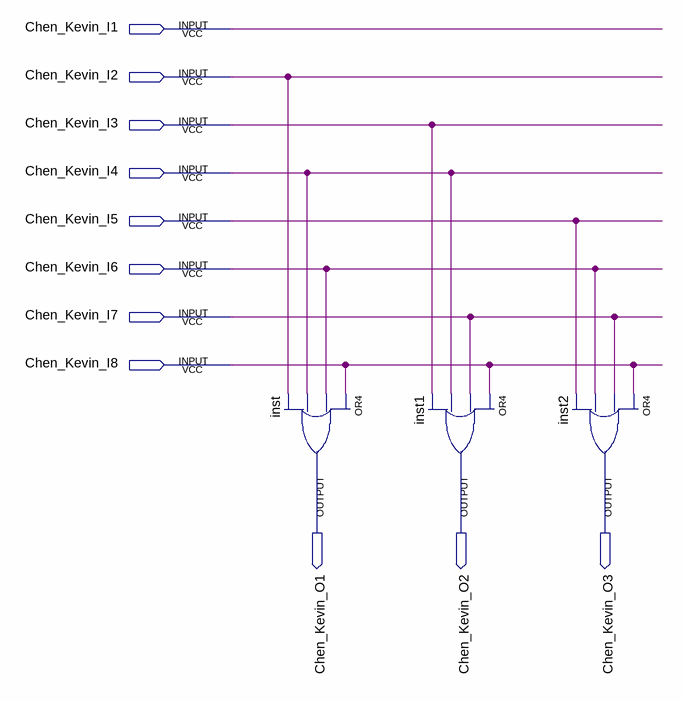
[diagram p0: schematic sheet]
// Quartus schematic Chen_Kevin_8To3Encoder.bdf as structural Verilog: 3 symbols, 11 pins
module Chen_Kevin_8To3Encoder (
  input  Chen_Kevin_I1,
  input  Chen_Kevin_I2,
  input  Chen_Kevin_I3,
  input  Chen_Kevin_I4,
  input  Chen_Kevin_I5,
  input  Chen_Kevin_I6,
  input  Chen_Kevin_I7,
  input  Chen_Kevin_I8,
  output Chen_Kevin_O1,
  output Chen_Kevin_O2,
  output Chen_Kevin_O3
);

  or inst (Chen_Kevin_O1, Chen_Kevin_I8, Chen_Kevin_I6, Chen_Kevin_I4, Chen_Kevin_I2);
  or inst1 (Chen_Kevin_O2, Chen_Kevin_I8, Chen_Kevin_I7, Chen_Kevin_I4, Chen_Kevin_I3);
  or inst2 (Chen_Kevin_O3, Chen_Kevin_I8, Chen_Kevin_I7, Chen_Kevin_I6, Chen_Kevin_I5);
endmodule
